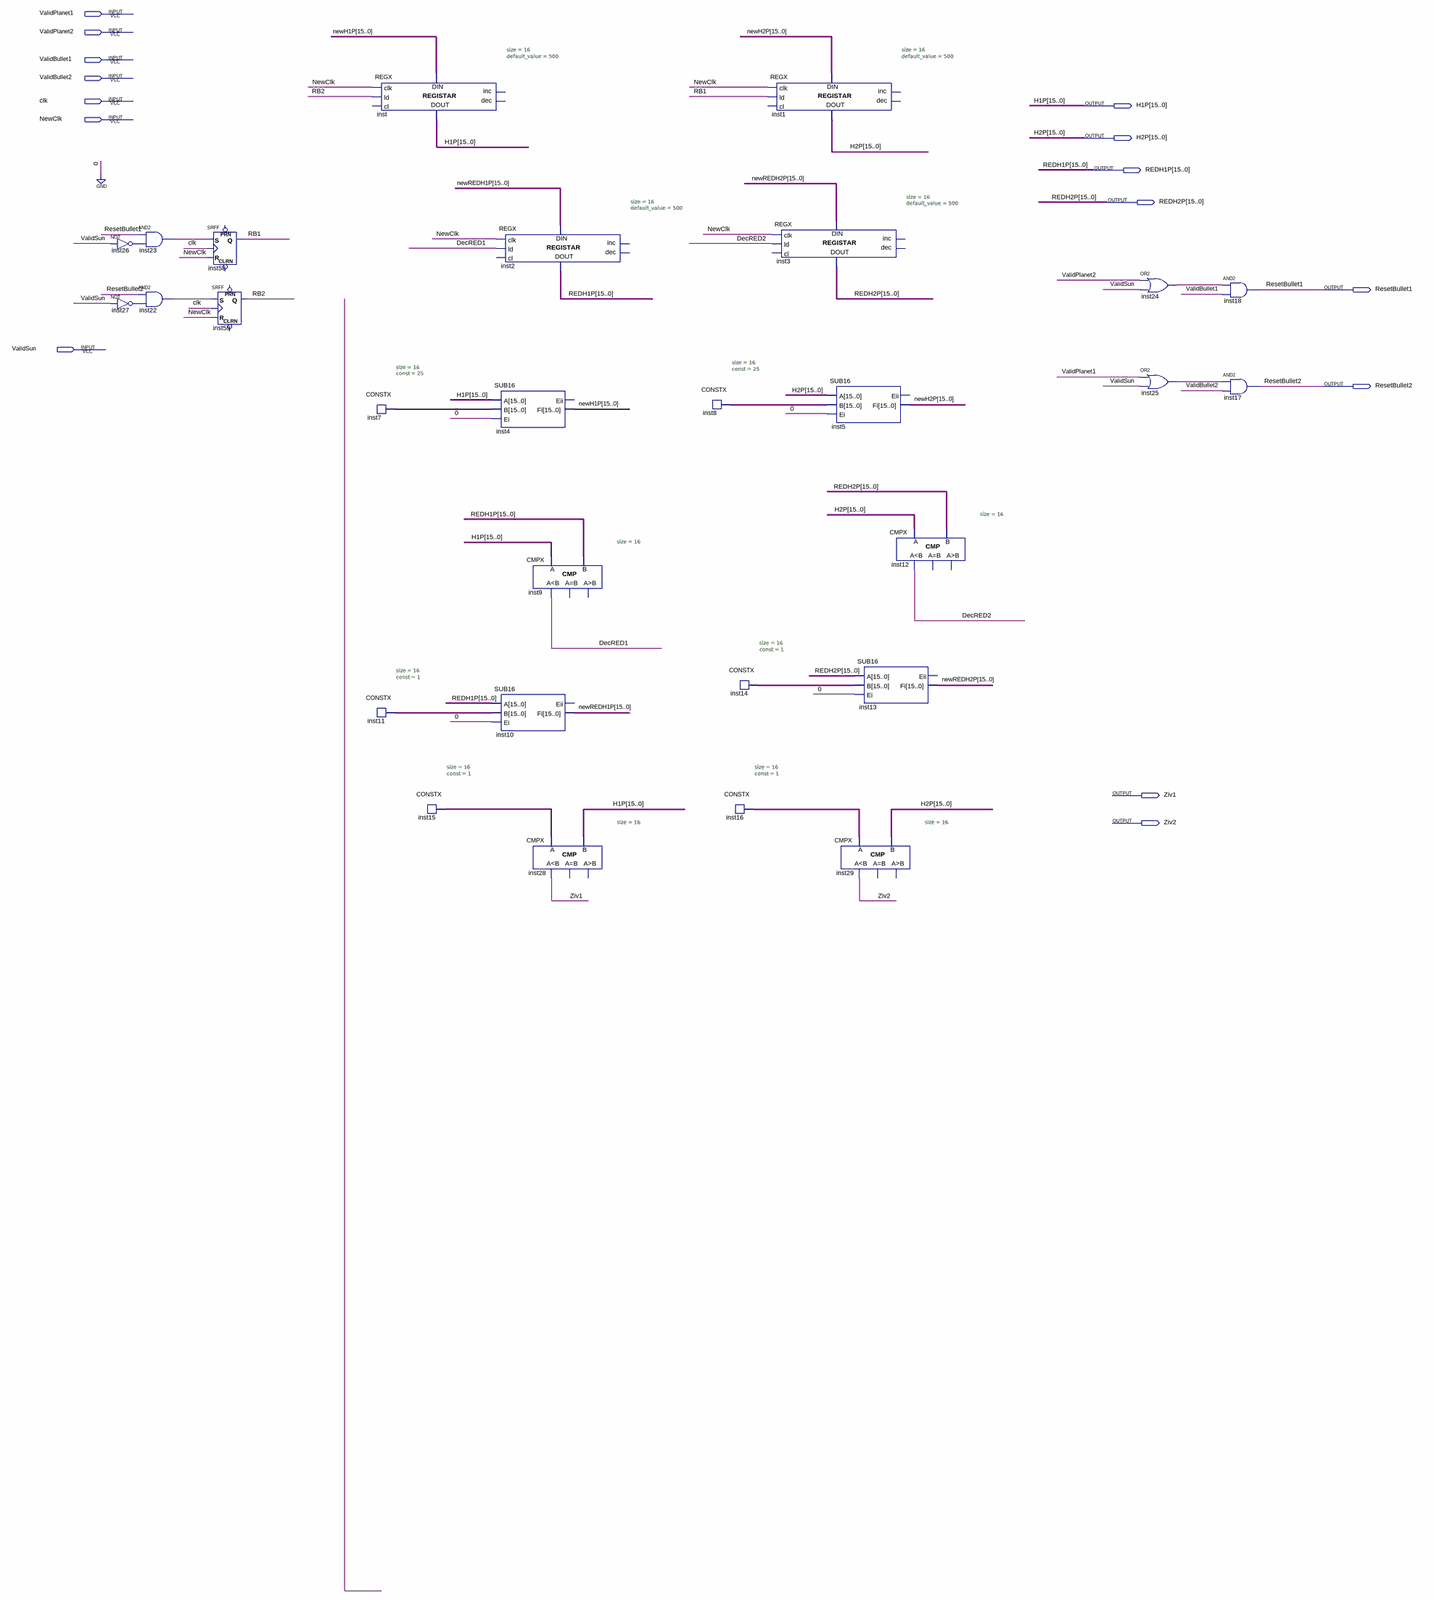
[diagram p0: schematic sheet, whole]
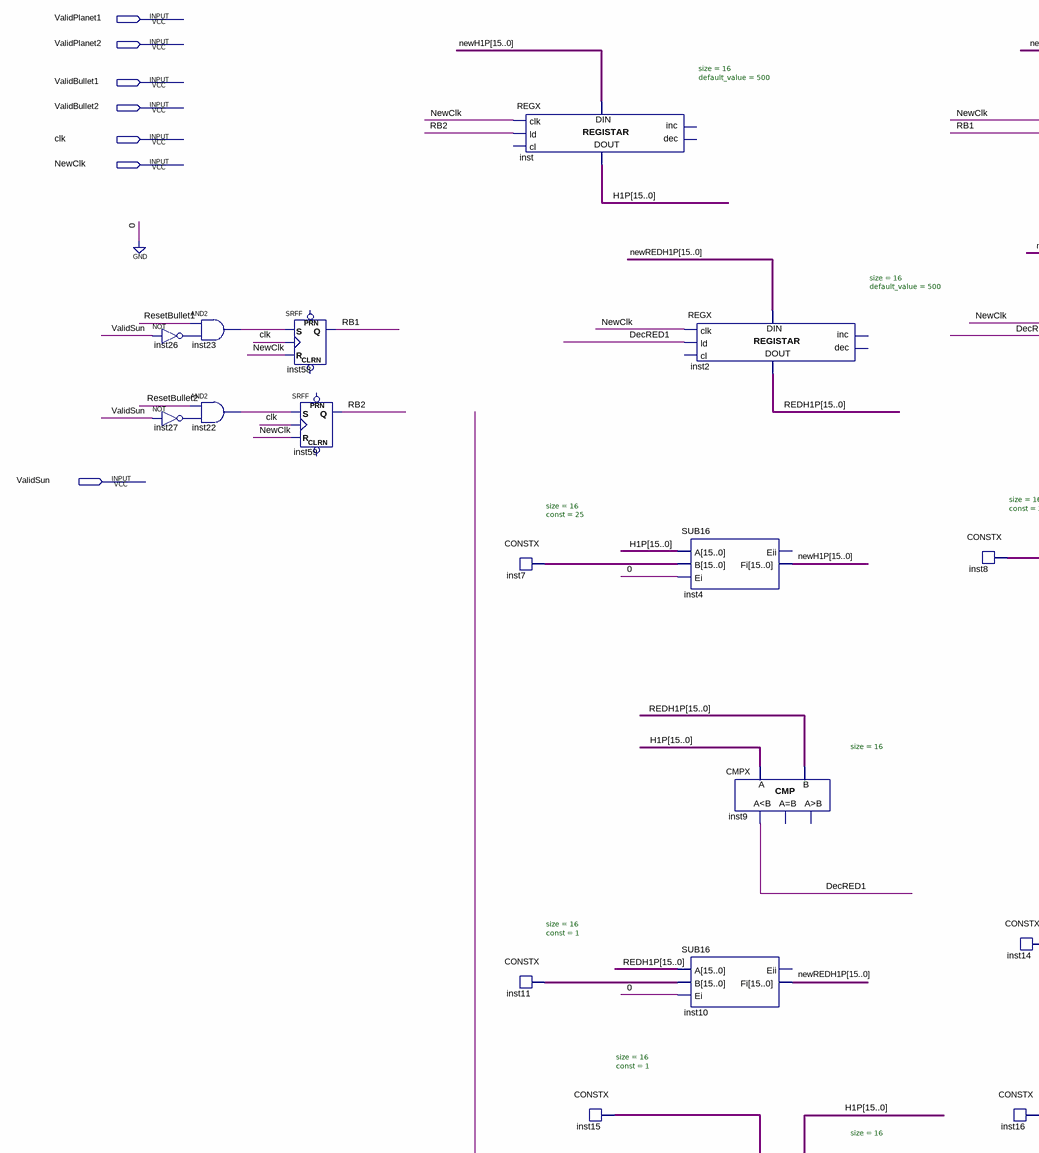
[diagram p1: schematic sheet, upper left part]
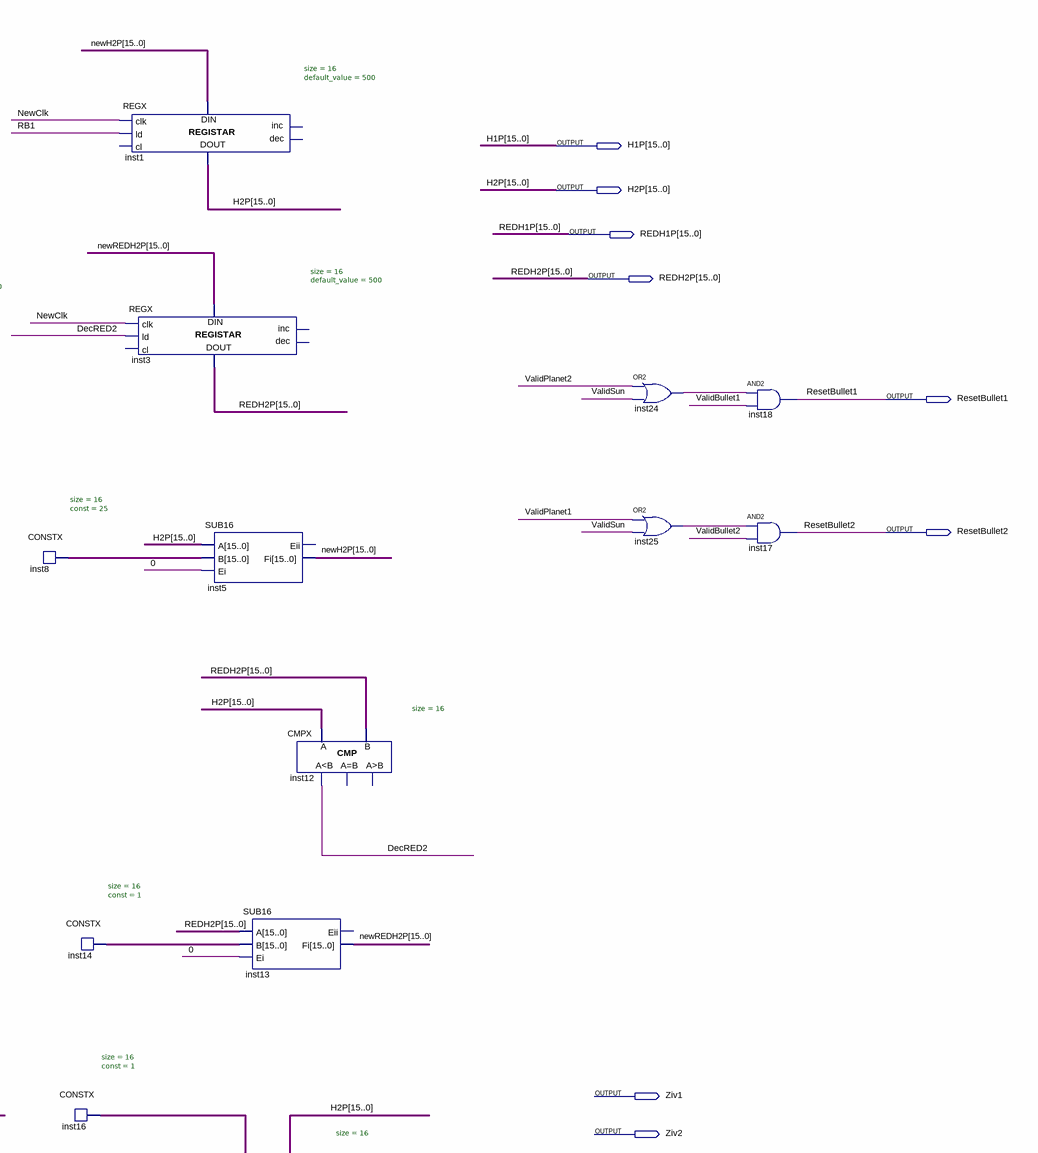
[diagram p2: schematic sheet, upper right part]
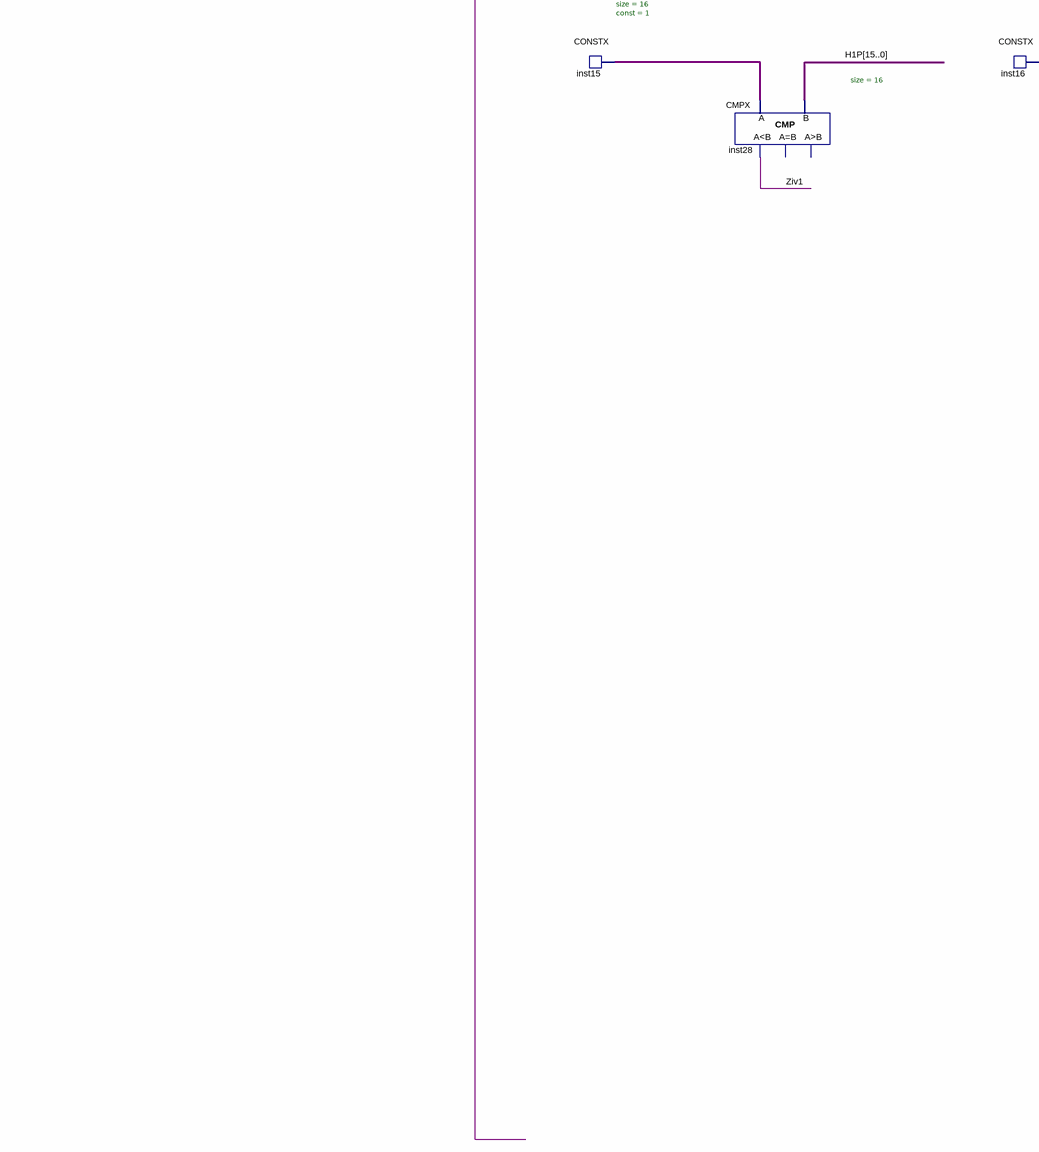
[diagram p3: schematic sheet, lower left part]
// Quartus schematic Colider.bdf as structural Verilog: 28 symbols, 15 pins
module Colider (
  input  ValidPlanet1,
  input  ValidPlanet2,
  input  ValidBullet1,
  input  ValidBullet2,
  input  clk,
  input  NewClk,
  input  ValidSun,
  output [15:0] H1P,
  output [15:0] H2P,
  output [15:0] REDH1P,
  output [15:0] REDH2P,
  output ResetBullet1,
  output ResetBullet2,
  output Ziv1,
  output Ziv2
);

  wire DecRED1, DecRED2, inst22_out, inst23_out, inst24_out, inst25_out, inst26_out, inst27_out, RB1, RB2;
  wire [15:0] inst7_data, inst8_data, inst11_data, inst14_data, inst15_data, inst16_data, newH1P, newH2P,
       newREDH1P, newREDH2P;

  not inst26 (inst26_out, ValidSun);
  not inst27 (inst27_out, ValidSun);
  and inst23 (inst23_out, ResetBullet1, inst26_out);
  and inst22 (inst22_out, ResetBullet2, inst27_out);
  SRFF inst58 (.S(inst23_out), .R(NewClk), .CLK(clk), .Q(RB1));  // open: PRN, CLRN
  SRFF inst59 (.S(inst22_out), .R(NewClk), .CLK(clk), .Q(RB2));  // open: PRN, CLRN
  REGX #(.size(16), .default_value(500)) inst (
    .clk(NewClk), .ld(RB2), .data_in(newH1P), .data_out(H1P));  // open: cl, inc, dec
  CONSTX #(.size(16), .\const (25)) inst7 (.data(inst7_data));
  CONSTX #(.size(16), .\const (1)) inst11 (.data(inst11_data));
  CONSTX #(.size(16), .\const (1)) inst15 (.data(inst15_data));
  REGX #(.size(16), .default_value(500)) inst2 (
    .clk(NewClk), .ld(DecRED1), .data_in(newREDH1P), .data_out(REDH1P));  // open: cl, inc, dec
  SUB16 inst4 (.A(H1P), .B(inst7_data), .Ei(1'b0), .Fi(newH1P));  // open: Eii
  SUB16 inst10 (.A(REDH1P), .B(inst11_data), .Ei(1'b0), .Fi(newREDH1P));  // open: Eii
  CMPX #(.size(16)) inst9 (.A(H1P), .B(REDH1P), .ls(DecRED1));  // open: eq, gr
  CMPX #(.size(16)) inst28 (.A(inst15_data), .B(H1P), .ls(Ziv1));  // open: eq, gr
  CONSTX #(.size(16), .\const (25)) inst8 (.data(inst8_data));
  CONSTX #(.size(16), .\const (1)) inst14 (.data(inst14_data));
  CONSTX #(.size(16), .\const (1)) inst16 (.data(inst16_data));
  REGX #(.size(16), .default_value(500)) inst1 (
    .clk(NewClk), .ld(RB1), .data_in(newH2P), .data_out(H2P));  // open: cl, inc, dec
  REGX #(.size(16), .default_value(500)) inst3 (
    .clk(NewClk), .ld(DecRED2), .data_in(newREDH2P), .data_out(REDH2P));  // open: cl, inc, dec
  SUB16 inst5 (.A(H2P), .B(inst8_data), .Ei(1'b0), .Fi(newH2P));  // open: Eii
  CMPX #(.size(16)) inst29 (.A(inst16_data), .B(H2P), .ls(Ziv2));  // open: eq, gr
  CMPX #(.size(16)) inst12 (.A(H2P), .B(REDH2P), .ls(DecRED2));  // open: eq, gr
  SUB16 inst13 (.A(REDH2P), .B(inst14_data), .Ei(1'b0), .Fi(newREDH2P));  // open: Eii
  or inst24 (inst24_out, ValidPlanet2, ValidSun);
  or inst25 (inst25_out, ValidPlanet1, ValidSun);
  and inst18 (ResetBullet1, inst24_out, ValidBullet1);
  and inst17 (ResetBullet2, inst25_out, ValidBullet2);
endmodule
